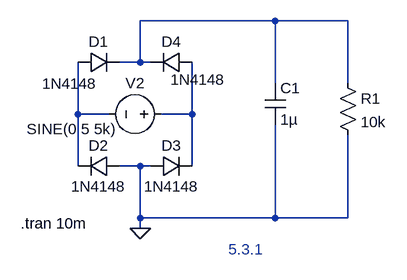
[diagram p0: schematic 5.3.1 1microF.asc]
5.3.1 1microF.asc, the LTspice schematic file:
Version 4
SHEET 1 1080 680
WIRE 896 -32 688 -32
WIRE 1008 -32 896 -32
WIRE 688 32 688 -32
WIRE 688 32 656 32
WIRE 704 32 688 32
WIRE 896 64 896 -32
WIRE 1008 64 1008 -32
WIRE 592 112 592 32
WIRE 640 112 592 112
WIRE 768 112 768 32
WIRE 768 112 720 112
WIRE 592 192 592 112
WIRE 688 192 656 192
WIRE 704 192 688 192
WIRE 768 192 768 112
WIRE 688 272 688 192
WIRE 896 272 896 128
WIRE 896 272 688 272
WIRE 1008 272 1008 144
WIRE 1008 272 896 272
WIRE 688 288 688 272
FLAG 688 288 0
SYMBOL voltage 736 112 R90
WINDOW 0 -32 56 VBottom 2
WINDOW 3 7 154 VTop 2
WINDOW 123 0 0 Left 0
WINDOW 39 0 0 Left 0
SYMATTR InstName V2
SYMATTR Value SINE(0 5 5k)
SYMBOL diode 656 176 R90
WINDOW 0 0 32 VBottom 2
WINDOW 3 32 32 VTop 2
SYMATTR InstName D2
SYMATTR Value 1N4148
SYMBOL diode 704 208 R270
WINDOW 0 32 32 VTop 2
WINDOW 3 0 32 VBottom 2
SYMATTR InstName D3
SYMATTR Value 1N4148
SYMBOL diode 592 48 R270
WINDOW 0 32 32 VTop 2
WINDOW 3 -1 -13 VBottom 2
SYMATTR InstName D1
SYMATTR Value 1N4148
SYMBOL diode 768 16 R90
WINDOW 0 0 32 VBottom 2
WINDOW 3 27 -9 VTop 2
SYMATTR InstName D4
SYMATTR Value 1N4148
SYMBOL res 992 48 R0
SYMATTR InstName R1
SYMATTR Value 10k
SYMBOL cap 880 64 R0
SYMATTR InstName C1
SYMATTR Value 1µ
TEXT 504 280 Left 2 !.tran 10m
TEXT 824 320 Left 2 ;5.3.1

The netlist it stands for:
* 5.3.1 1microF.asc
V2 N003 N002 SINE(0 5 5k)
D2 0 N002 1N4148
D3 0 N003 1N4148
D1 N002 N001 1N4148
D4 N003 N001 1N4148
R1 N001 0 10k
C1 N001 0 1µ
.model D D
.lib standard.dio
.tran 10m
* 5.3.1
.backanno
.end